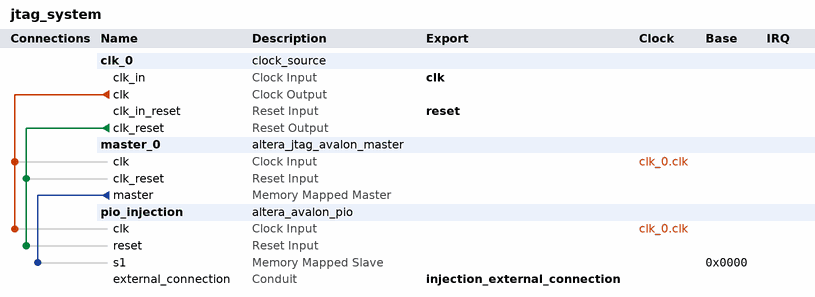
[diagram p0: system contents]
# Platform Designer (Qsys) system jtag_system, Cyclone V 5CSEBA6U23I7
# Parameters at their usual value, and those the tool derives, are not listed.
package require -exact qsys 24.1
create_system jtag_system
set_project_property DEVICE_FAMILY {Cyclone V}
set_project_property DEVICE 5CSEBA6U23I7

add_instance clk_0 clock_source 24.1
set_instance_parameter_value clk_0 clockFrequency 50000000
set_instance_parameter_value clk_0 resetSynchronousEdges DEASSERT

add_instance master_0 altera_jtag_avalon_master 24.1

add_instance pio_injection altera_avalon_pio 24.1
set_instance_parameter_value pio_injection direction Output
set_instance_parameter_value pio_injection width 32

# connections
add_connection clk_0.clk master_0.clk clock
add_connection clk_0.clk pio_injection.clk clock
add_connection clk_0.clk_reset master_0.clk_reset reset
add_connection clk_0.clk_reset pio_injection.reset reset
add_connection master_0.master pio_injection.s1 avalon
set_connection_parameter_value master_0.master/pio_injection.s1 baseAddress 0x0000

# exported interfaces
add_interface clk clock sink
set_interface_property clk EXPORT_OF clk_0.clk_in
add_interface injection_external_connection conduit end
set_interface_property injection_external_connection EXPORT_OF pio_injection.external_connection
add_interface reset reset sink
set_interface_property reset EXPORT_OF clk_0.clk_in_reset

set_interconnect_requirement {$system} qsys_mm.clockCrossingAdapter HANDSHAKE
set_interconnect_requirement {$system} qsys_mm.enableEccProtection FALSE
set_interconnect_requirement {$system} qsys_mm.insertDefaultSlave FALSE
set_interconnect_requirement {$system} qsys_mm.maxAdditionalLatency 1

save_system jtag_system.qsys
